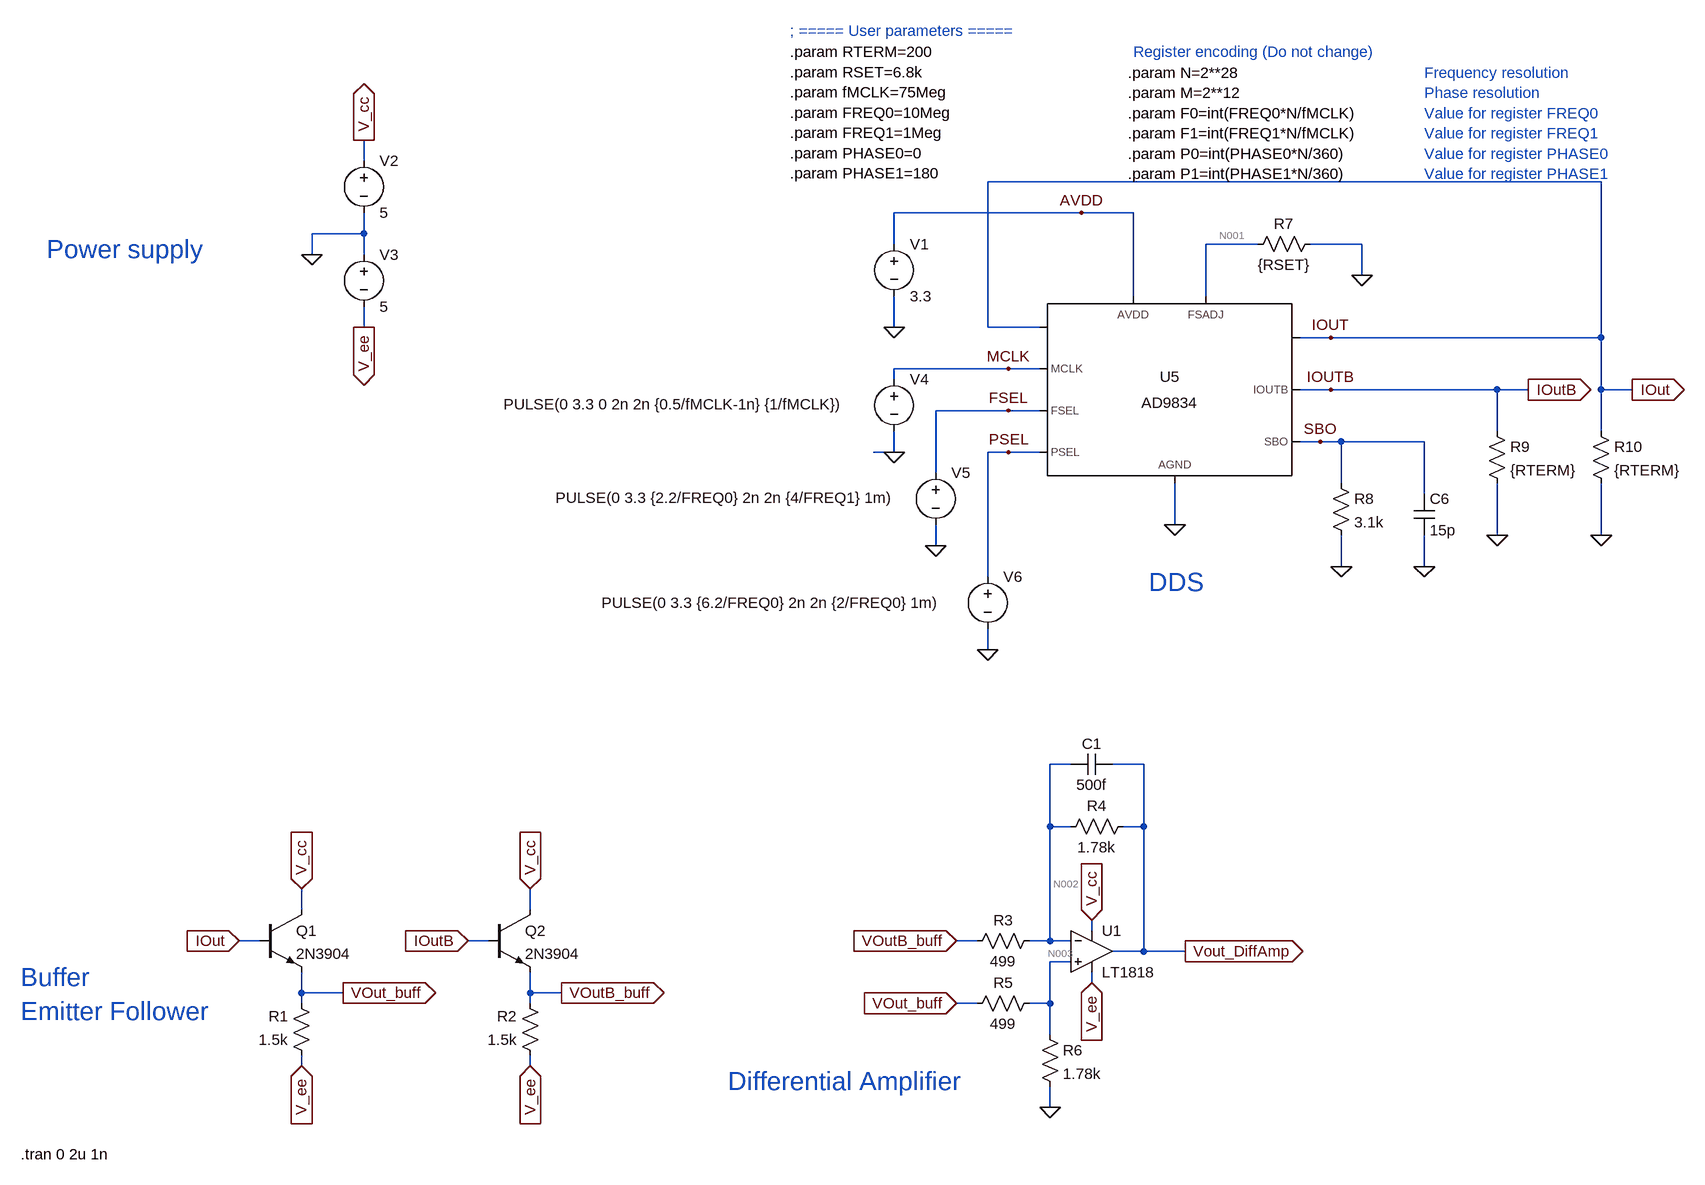
[diagram p0: schematic DDS_Diff-to-Single_ver01.asc]
DDS_Diff-to-Single_ver01.asc, the LTspice schematic file:
Version 4.1
SHEET 1 2412 1356
WIRE -1392 -1072 -1392 -1104
WIRE 512 -1040 -432 -1040
WIRE -288 -992 -576 -992
WIRE -208 -992 -288 -992
WIRE -1392 -960 -1392 -992
WIRE -1392 -960 -1472 -960
WIRE -576 -944 -576 -992
WIRE -16 -944 -96 -944
WIRE 144 -944 64 -944
WIRE -1472 -928 -1472 -960
WIRE -1392 -928 -1392 -960
WIRE 144 -896 144 -944
WIRE -208 -864 -208 -992
WIRE -96 -864 -96 -944
WIRE -1392 -816 -1392 -848
WIRE -576 -816 -576 -864
WIRE -432 -816 -432 -1040
WIRE -352 -816 -432 -816
WIRE 96 -800 48 -800
WIRE 512 -800 512 -1040
WIRE 512 -800 96 -800
WIRE -400 -752 -576 -752
WIRE -352 -752 -400 -752
WIRE -576 -736 -576 -752
WIRE 96 -720 48 -720
WIRE 352 -720 96 -720
WIRE 400 -720 352 -720
WIRE 512 -720 512 -800
WIRE 560 -720 512 -720
WIRE -400 -688 -512 -688
WIRE -352 -688 -400 -688
WIRE 352 -656 352 -720
WIRE 512 -656 512 -720
WIRE 80 -640 48 -640
WIRE 112 -640 80 -640
WIRE 240 -640 112 -640
WIRE -576 -624 -576 -656
WIRE -576 -624 -608 -624
WIRE -400 -624 -432 -624
WIRE -352 -624 -400 -624
WIRE -512 -592 -512 -688
WIRE 112 -576 112 -640
WIRE 240 -560 240 -640
WIRE -144 -512 -144 -576
WIRE 352 -496 352 -576
WIRE 512 -496 512 -576
WIRE -512 -480 -512 -512
WIRE 112 -448 112 -496
WIRE 240 -448 240 -496
WIRE -432 -432 -432 -624
WIRE -432 -320 -432 -352
WIRE -304 -144 -336 -144
WIRE -192 -144 -240 -144
WIRE -336 -48 -336 -144
WIRE -304 -48 -336 -48
WIRE -192 -48 -192 -144
WIRE -192 -48 -224 -48
WIRE -1488 80 -1488 48
WIRE -1136 80 -1136 48
WIRE -272 112 -272 96
WIRE -1552 128 -1584 128
WIRE -1200 128 -1232 128
WIRE -448 128 -480 128
WIRE -336 128 -336 -48
WIRE -336 128 -368 128
WIRE -304 128 -336 128
WIRE -192 144 -192 -48
WIRE -192 144 -240 144
WIRE -128 144 -192 144
WIRE -304 160 -336 160
WIRE -272 192 -272 176
WIRE -1488 208 -1488 176
WIRE -1424 208 -1488 208
WIRE -1136 208 -1136 176
WIRE -1088 208 -1136 208
WIRE -1488 224 -1488 208
WIRE -1136 224 -1136 208
WIRE -448 224 -480 224
WIRE -336 224 -336 160
WIRE -336 224 -368 224
WIRE -336 272 -336 224
WIRE -1488 320 -1488 304
WIRE -1136 320 -1136 304
WIRE -336 384 -336 352
FLAG -1472 -928 0
FLAG -1392 -1104 V_cc
IOPIN -1392 -1104 Out
FLAG -1392 -816 V_ee
IOPIN -1392 -816 Out
FLAG -576 -816 0
FLAG -576 -624 0
FLAG -512 -480 0
FLAG -432 -320 0
FLAG -144 -512 0
FLAG 112 -448 0
FLAG 240 -448 0
FLAG 144 -896 0
FLAG 96 -800 IOUT
FLAG 96 -720 IOUTB
FLAG 80 -640 SBO
FLAG -400 -752 MCLK
FLAG -400 -688 FSEL
FLAG -400 -624 PSEL
FLAG -288 -992 AVDD
FLAG 512 -496 0
FLAG 352 -496 0
FLAG 560 -720 IOut
IOPIN 560 -720 Out
FLAG 400 -720 IOutB
IOPIN 400 -720 Out
FLAG -1584 128 IOut
IOPIN -1584 128 In
FLAG -1232 128 IOutB
IOPIN -1232 128 In
FLAG -1488 48 V_cc
IOPIN -1488 48 In
FLAG -1136 48 V_cc
IOPIN -1136 48 In
FLAG -1488 320 V_ee
IOPIN -1488 320 In
FLAG -1136 320 V_ee
IOPIN -1136 320 In
FLAG -272 96 V_cc
IOPIN -272 96 In
FLAG -272 192 V_ee
IOPIN -272 192 In
FLAG -1424 208 VOut_buff
IOPIN -1424 208 Out
FLAG -1088 208 VOutB_buff
IOPIN -1088 208 Out
FLAG -480 128 VOutB_buff
IOPIN -480 128 In
FLAG -480 224 VOut_buff
IOPIN -480 224 In
FLAG -336 384 0
FLAG -128 144 Vout_DiffAmp
IOPIN -128 144 Out
SYMBOL voltage -1392 -1088 R0
SYMATTR InstName V2
SYMATTR Value 5
SYMBOL voltage -1392 -944 R0
WINDOW 123 0 0 Left 0
WINDOW 39 0 0 Left 0
SYMATTR InstName V3
SYMATTR Value 5
SYMBOL DAC\\AD9834 -144 -720 R0
SYMATTR InstName U5
SYMATTR SpiceLine TYPE=0 COMP=1 PHASE0={P0} PHASE1={P1}
SYMATTR SpiceLine2 fMCLK={fMCLK} FREQ0={F0} FREQ1={F1}
SYMBOL voltage -576 -960 R0
WINDOW 123 0 0 Left 0
WINDOW 39 0 0 Left 0
SYMATTR InstName V1
SYMATTR Value 3.3
SYMBOL voltage -576 -752 R0
WINDOW 3 -601 54 Left 2
WINDOW 123 0 0 Left 0
WINDOW 39 0 0 Left 0
SYMATTR Value PULSE(0 3.3 0 2n 2n {0.5/fMCLK-1n} {1/fMCLK})
SYMATTR InstName V4
SYMBOL voltage -512 -608 R0
WINDOW 3 -585 54 Left 2
WINDOW 123 0 0 Left 0
WINDOW 39 0 0 Left 0
SYMATTR Value PULSE(0 3.3 {2.2/FREQ0} 2n 2n {4/FREQ1} 1m)
SYMATTR InstName V5
SYMBOL voltage -432 -448 R0
WINDOW 3 -594 56 Left 2
WINDOW 123 0 0 Left 0
WINDOW 39 0 0 Left 0
SYMATTR Value PULSE(0 3.3 {6.2/FREQ0} 2n 2n {2/FREQ0} 1m)
SYMATTR InstName V6
SYMBOL res 80 -960 R90
WINDOW 0 0 56 VBottom 2
WINDOW 3 32 56 VTop 2
SYMATTR InstName R7
SYMATTR Value {RSET}
SYMBOL res 96 -592 R0
SYMATTR InstName R8
SYMATTR Value 3.1k
SYMBOL cap 224 -560 R0
SYMATTR InstName C6
SYMATTR Value 15p
SYMBOL res 336 -672 R0
SYMATTR InstName R9
SYMATTR Value {RTERM}
SYMBOL res 496 -672 R0
SYMATTR InstName R10
SYMATTR Value {RTERM}
SYMBOL npn -1552 80 R0
SYMATTR InstName Q1
SYMATTR Value 2N3904
SYMBOL npn -1200 80 R0
SYMATTR InstName Q2
SYMATTR Value 2N3904
SYMBOL res -1472 320 R180
WINDOW 0 36 76 Left 2
WINDOW 3 36 40 Left 2
SYMATTR InstName R1
SYMATTR Value 1.5k
SYMBOL res -1120 320 R180
WINDOW 0 36 76 Left 2
WINDOW 3 36 40 Left 2
SYMATTR InstName R2
SYMATTR Value 1.5k
SYMBOL OpAmps\\LT1818 -272 144 R0
SYMATTR InstName U1
SYMBOL res -352 112 R90
WINDOW 0 0 56 VBottom 2
WINDOW 3 32 56 VTop 2
SYMATTR InstName R3
SYMATTR Value 499
SYMBOL res -208 -64 R90
WINDOW 0 0 56 VBottom 2
WINDOW 3 32 56 VTop 2
SYMATTR InstName R4
SYMATTR Value 1.78k
SYMBOL cap -240 -160 R90
WINDOW 0 0 32 VBottom 2
WINDOW 3 32 32 VTop 2
SYMATTR InstName C1
SYMATTR Value 500f
SYMBOL res -352 208 R90
WINDOW 0 0 56 VBottom 2
WINDOW 3 32 56 VTop 2
SYMATTR InstName R5
SYMATTR Value 499
SYMBOL res -352 256 R0
SYMATTR InstName R6
SYMATTR Value 1.78k
TEXT -1880 -936 Left 4 ;Power supply
TEXT -736 -1240 Left 2 !.param RTERM=200\n.param RSET=6.8k\n.param fMCLK=75Meg\n.param FREQ0=10Meg\n.param FREQ1=1Meg\n.param PHASE0=0\n.param PHASE1=180
TEXT -736 -1272 Left 2 ;; ===== User parameters =====
TEXT -216 -1208 Left 2 !.param N=2**28\n.param M=2**12\n.param F0=int(FREQ0*N/fMCLK)\n.param F1=int(FREQ1*N/fMCLK)\n.param P0=int(PHASE0*N/360)\n.param P1=int(PHASE1*N/360)
TEXT -208 -1240 Left 2 ;Register encoding (Do not change)
TEXT 240 -1208 Left 2 ;Frequency resolution\nPhase resolution\nValue for register FREQ0\nValue for register FREQ1\nValue for register PHASE0\nValue for register PHASE1
TEXT -1920 184 Left 4 ;Buffer\nEmitter Follower
TEXT -1920 456 Left 2 !.tran 0 2u 1n
TEXT -832 344 Left 4 ;Differential Amplifier
TEXT -184 -424 Left 4 ;DDS

The netlist it stands for:
* DDS_Diff-to-Single_ver01.asc
V2 V_cc 0 5
V3 0 V_ee 5
X§U5 MCLK FSEL PSEL AVDD 0 N001 IOUT IOUTB SBO IOUT AD9834 TYPE=0 COMP=1 PHASE0={P0} PHASE1={P1} fMCLK={fMCLK} FREQ0={F0} FREQ1={F1}  ; pins MCLK FSEL PSEL AVDD AGND FSADJ ? IOUTB SBO ?
V1 AVDD 0 3.3
V4 MCLK 0 PULSE(0 3.3 0 2n 2n {0.5/fMCLK-1n} {1/fMCLK})
V5 FSEL 0 PULSE(0 3.3 {2.2/FREQ0} 2n 2n {4/FREQ1} 1m)
V6 PSEL 0 PULSE(0 3.3 {6.2/FREQ0} 2n 2n {2/FREQ0} 1m)
R7 0 N001 {RSET}
R8 SBO 0 3.1k
C6 SBO 0 15p
R9 IOUTB 0 {RTERM}
R10 IOUT 0 {RTERM}
Q1 V_cc IOUT VOut_buff 0 2N3904
Q2 V_cc IOUTB VOutB_buff 0 2N3904
R1 V_ee VOut_buff 1.5k
R2 V_ee VOutB_buff 1.5k
X§U1 N003 N002 Vout_DiffAmp V_cc V_ee LT1818  ; pins In+ In- OUT V+ V-
R3 N002 VOutB_buff 499
R4 Vout_DiffAmp N002 1.78k
C1 Vout_DiffAmp N002 500f
R5 N003 VOut_buff 499
R6 N003 0 1.78k
.model NPN NPN
.model PNP PNP
.lib standard.bjt
* Power supply
.param RTERM=200
.param RSET=6.8k
.param fMCLK=75Meg
.param FREQ0=10Meg
.param FREQ1=1Meg
.param PHASE0=0
.param PHASE1=180
* ; ===== User parameters =====
.param N=2**28
.param M=2**12
.param F0=int(FREQ0*N/fMCLK)
.param F1=int(FREQ1*N/fMCLK)
.param P0=int(PHASE0*N/360)
.param P1=int(PHASE1*N/360)
* Register encoding (Do not change)
* Frequency resolution
* Phase resolution
* Value for register FREQ0
* Value for register FREQ1
* Value for register PHASE0
* Value for register PHASE1
* Buffer
* Emitter Follower
.tran 0 2u 1n
* Differential Amplifier
* DDS
.lib AD9834.sub
.lib LTC2.lib
.backanno
.end

* Results of the author's LTspice run, read from the files saved beside the schematic
* Operating Point, zero values left out:
*   V(avdd) = 3.3 V
*   V(iout) = 321.1 mV
*   V(ioutb) = 320.5 mV
*   V(n001) = 1.15 V
*   V(n002) = -281.4 mV
*   V(n003) = -281.4 mV
*   V(v_cc) = 5 V
*   V(v_ee) = -5 V
*   V(vout_buff) = -361.3 mV
*   V(vout_diffamp) = 1.949 mV
*   V(voutb_buff) = -361.8 mV
*   I(R1) = -3.092 mA
*   I(R10) = 1.605 mA
*   I(R2) = -3.092 mA
*   I(R3) = 161.2 µA
*   I(R4) = 159.2 µA
*   I(R5) = 160.1 µA
*   I(R6) = -158.1 µA
*   I(R7) = -169.1 µA
*   I(R9) = 1.603 mA
*   I(V1) = -4.064 mA
*   I(V2) = -14.93 mA
*   I(V3) = -15.11 mA
*   I(V4) = 1 µA
*   I(V5) = 1 µA
*   I(V6) = 1 µA
*   Ib(Q1) = 9.373 µA
*   Ib(Q2) = 9.368 µA
*   Ic(Q1) = 2.923 mA
*   Ic(Q2) = 2.922 mA
*   Ie(Q1) = -2.932 mA
*   Ie(Q2) = -2.931 mA
*   Ix(u1:1) = -2.028 µA
*   Ix(u1:2) = -2.028 µA
*   Ix(u1:3) = -159.2 µA
*   Ix(u1:4) = 9.087 mA
*   Ix(u1:5) = -8.924 mA
*   Ix(u5:1) = -1 µA
*   Ix(u5:2) = -1 µA
*   Ix(u5:3) = -1 µA
*   Ix(u5:4) = 4.064 mA
*   Ix(u5:5) = -664.9 µA
*   Ix(u5:6) = -169.1 µA
*   Ix(u5:7) = -1.615 mA
*   Ix(u5:8) = -1.612 mA
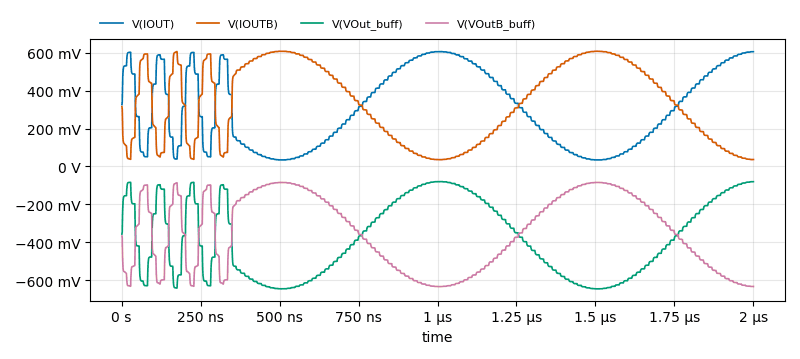
[diagram p1: Transient Analysis of DDS_Diff-to-Single_ver01.asc, plotted from the saved traces]
* Transient Analysis, 1 run:
*   V(IOUT): min 34.46 mV, max 605.6 mV, average 304.3 mV, rms 366.3 mV, last 604.9 mV
*   V(IOUTB): min 35.91 mV, max 607.4 mV, average 337.2 mV, rms 394.1 mV, last 36.56 mV
*   V(VOut_buff): min -644.8 mV, max -79.49 mV, average -377.8 mV, rms 428.2 mV, last -80.14 mV
*   V(VOutB_buff): min -633 mV, max -84.08 mV, average -344.7 mV, rms 396.6 mV, last -632.4 mV